# EAGLE design 01_FETCH_INCREMENT (EAGLE 7.5.0)
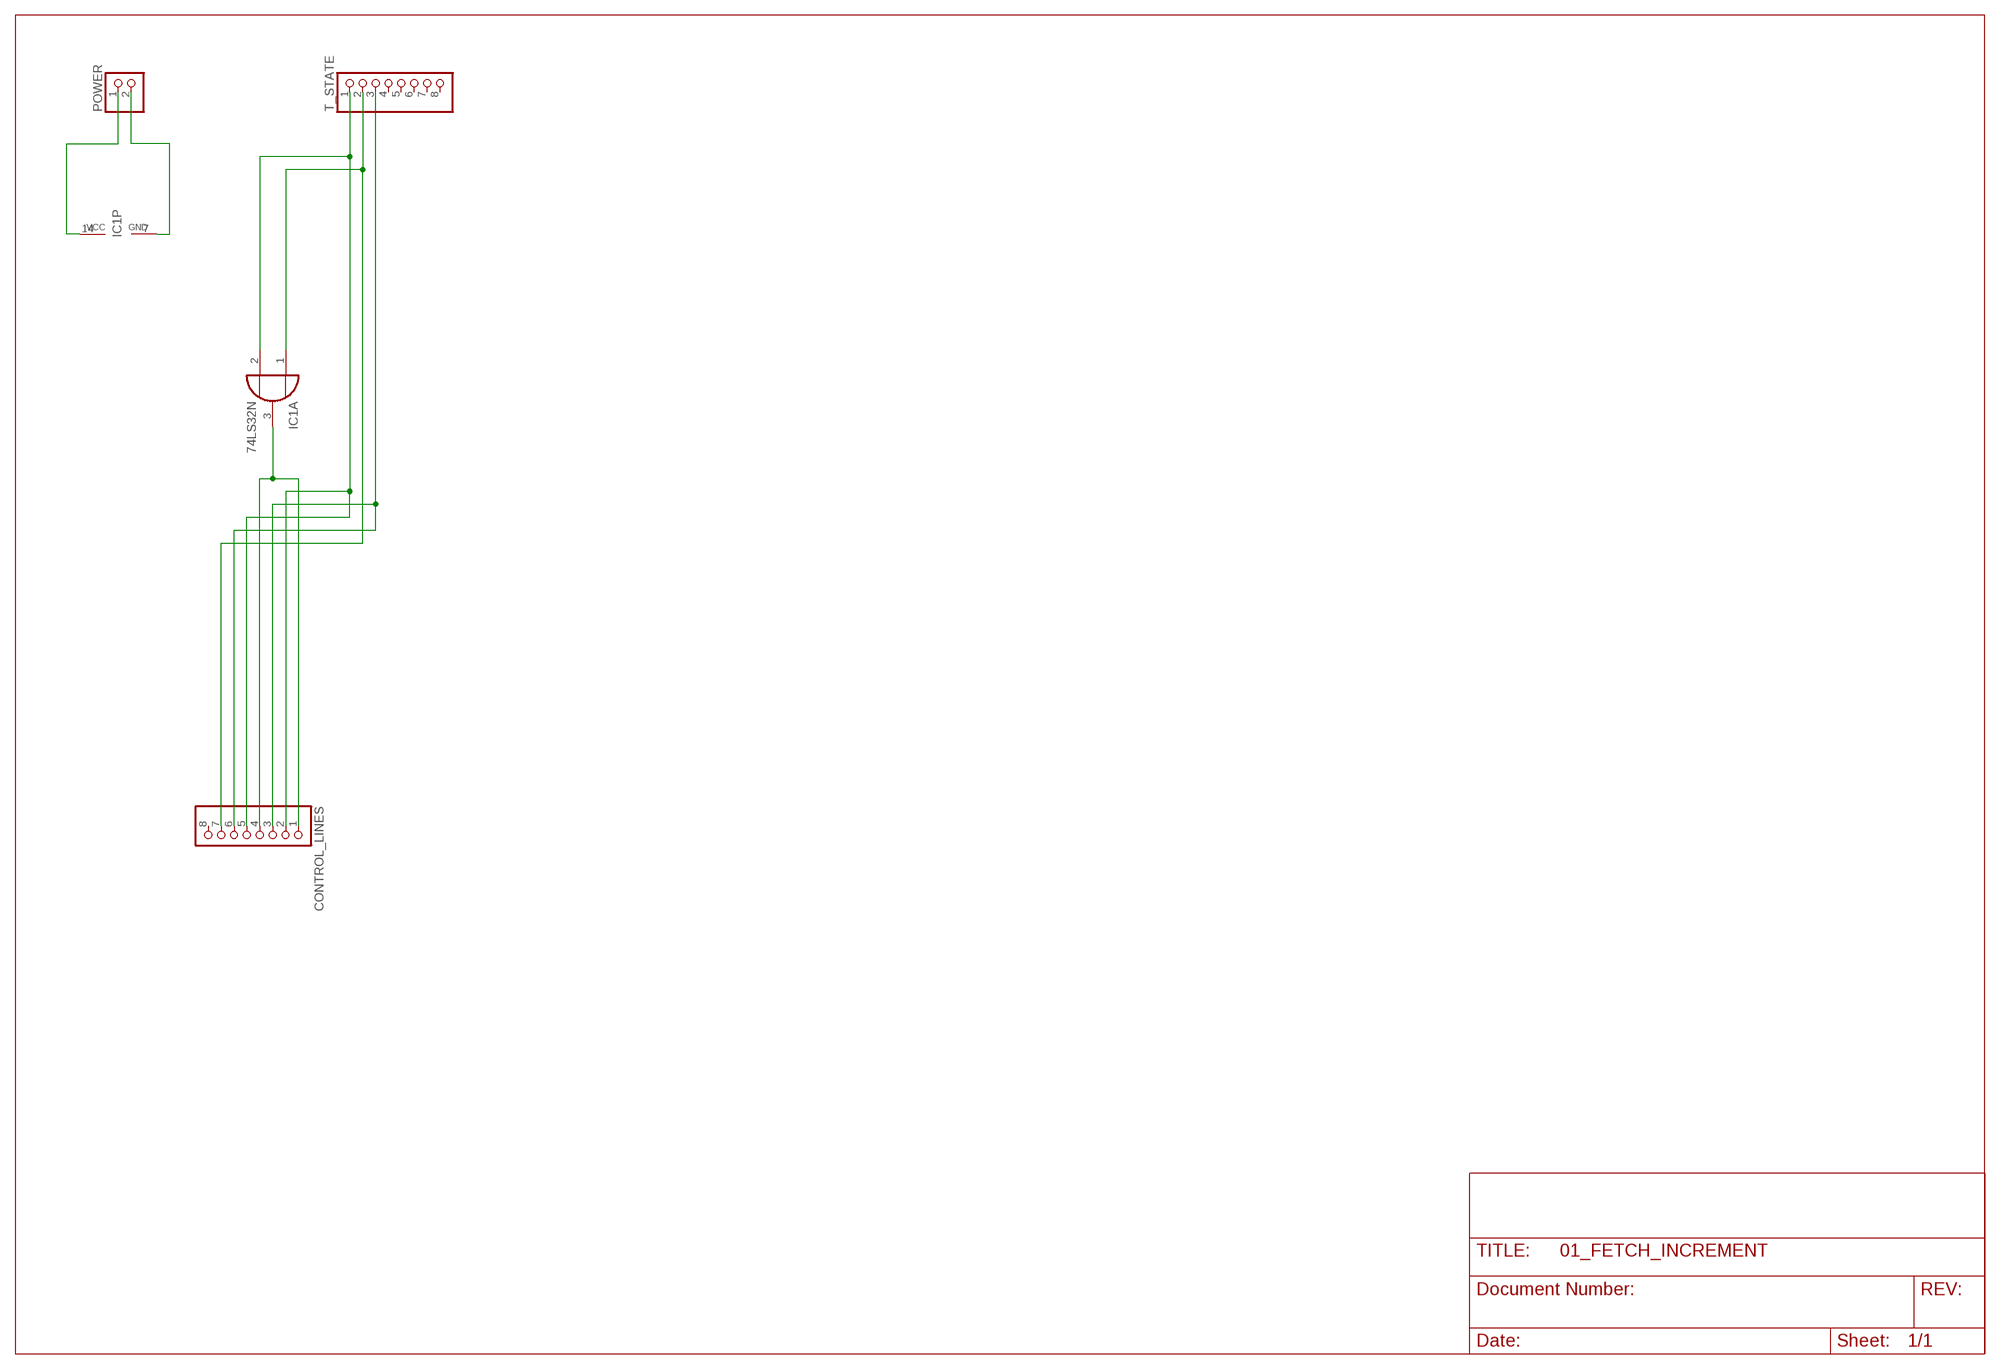
[diagram p0: schematic, sheet 1]

## Parts
CONTROL_LINES  PINHD-1X8  [1X08]
IC1  74LS32N  [DIL14]
POWER  PINHD-1X2  [1X02]
T_STATE  PINHD-1X8  [1X08]

## Nets
GND: IC1.7(P:GND) POWER.2
N$1: CONTROL_LINES.2 CONTROL_LINES.5 IC1.2(A:I1) T_STATE.1
N$2: CONTROL_LINES.7 IC1.1(A:I0) T_STATE.2
N$3: CONTROL_LINES.1 CONTROL_LINES.4 IC1.3(A:O)
N$5: CONTROL_LINES.3 CONTROL_LINES.6 T_STATE.3
VCC: IC1.14(P:VCC) POWER.1
Unconnected: CONTROL_LINES.8 IC1.4(B:I0) IC1.5(B:I1) IC1.6(B:O) IC1.8(C:O) IC1.9(C:I0) IC1.10(C:I1) IC1.11(D:O) IC1.12(D:I0) IC1.13(D:I1) T_STATE.4 T_STATE.5 T_STATE.6 T_STATE.7 T_STATE.8

## Library data of the parts
CONTROL_LINES T_STATE = pinhead:PINHD-1X8: PIN HEADER
IC1 = 74xx-eu:74*32: Quad 2-input OR gate
POWER = pinhead:PINHD-1X2: PIN HEADER

## Board
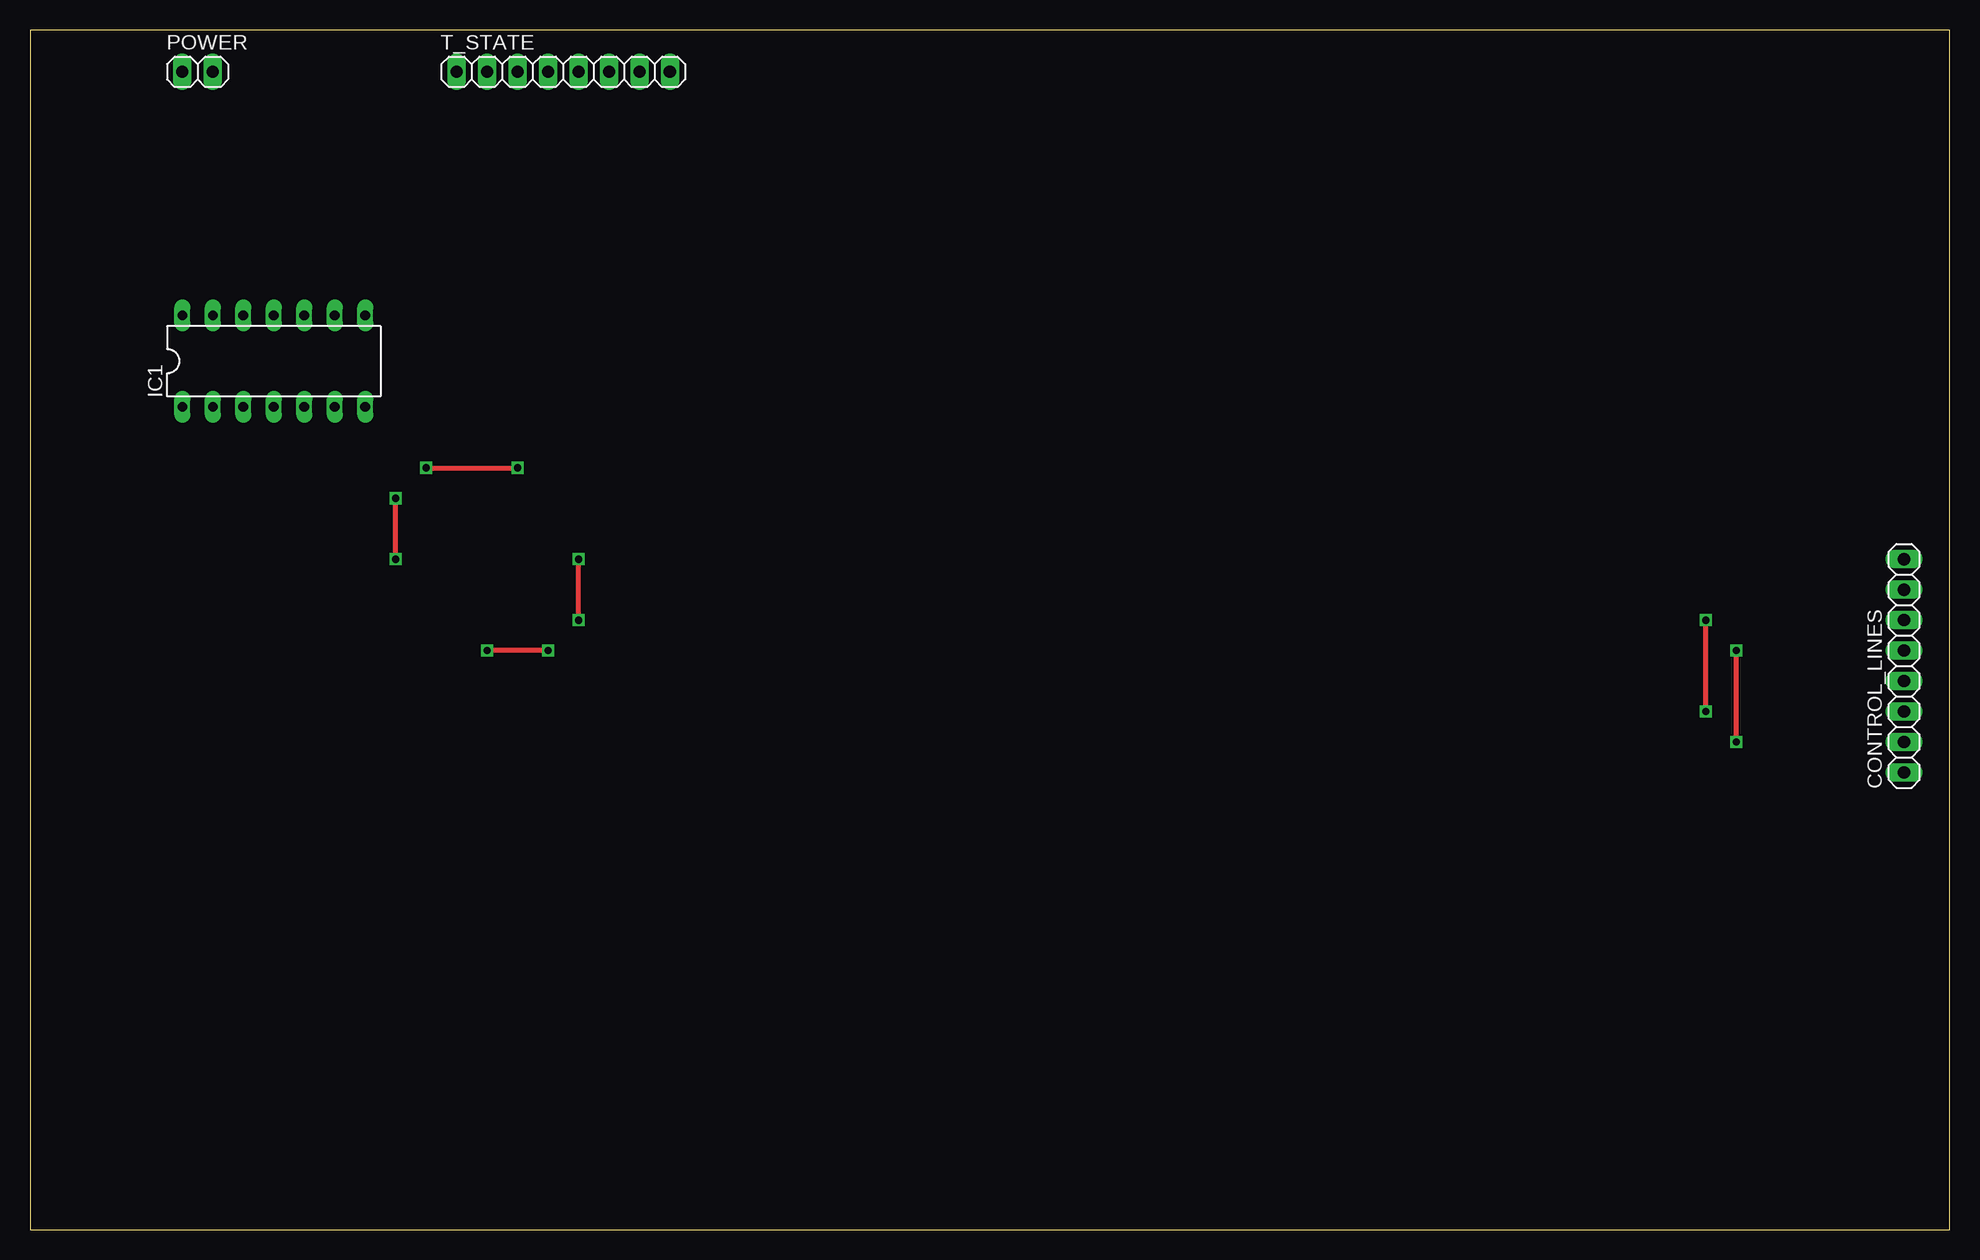
[diagram p1: board, top side]
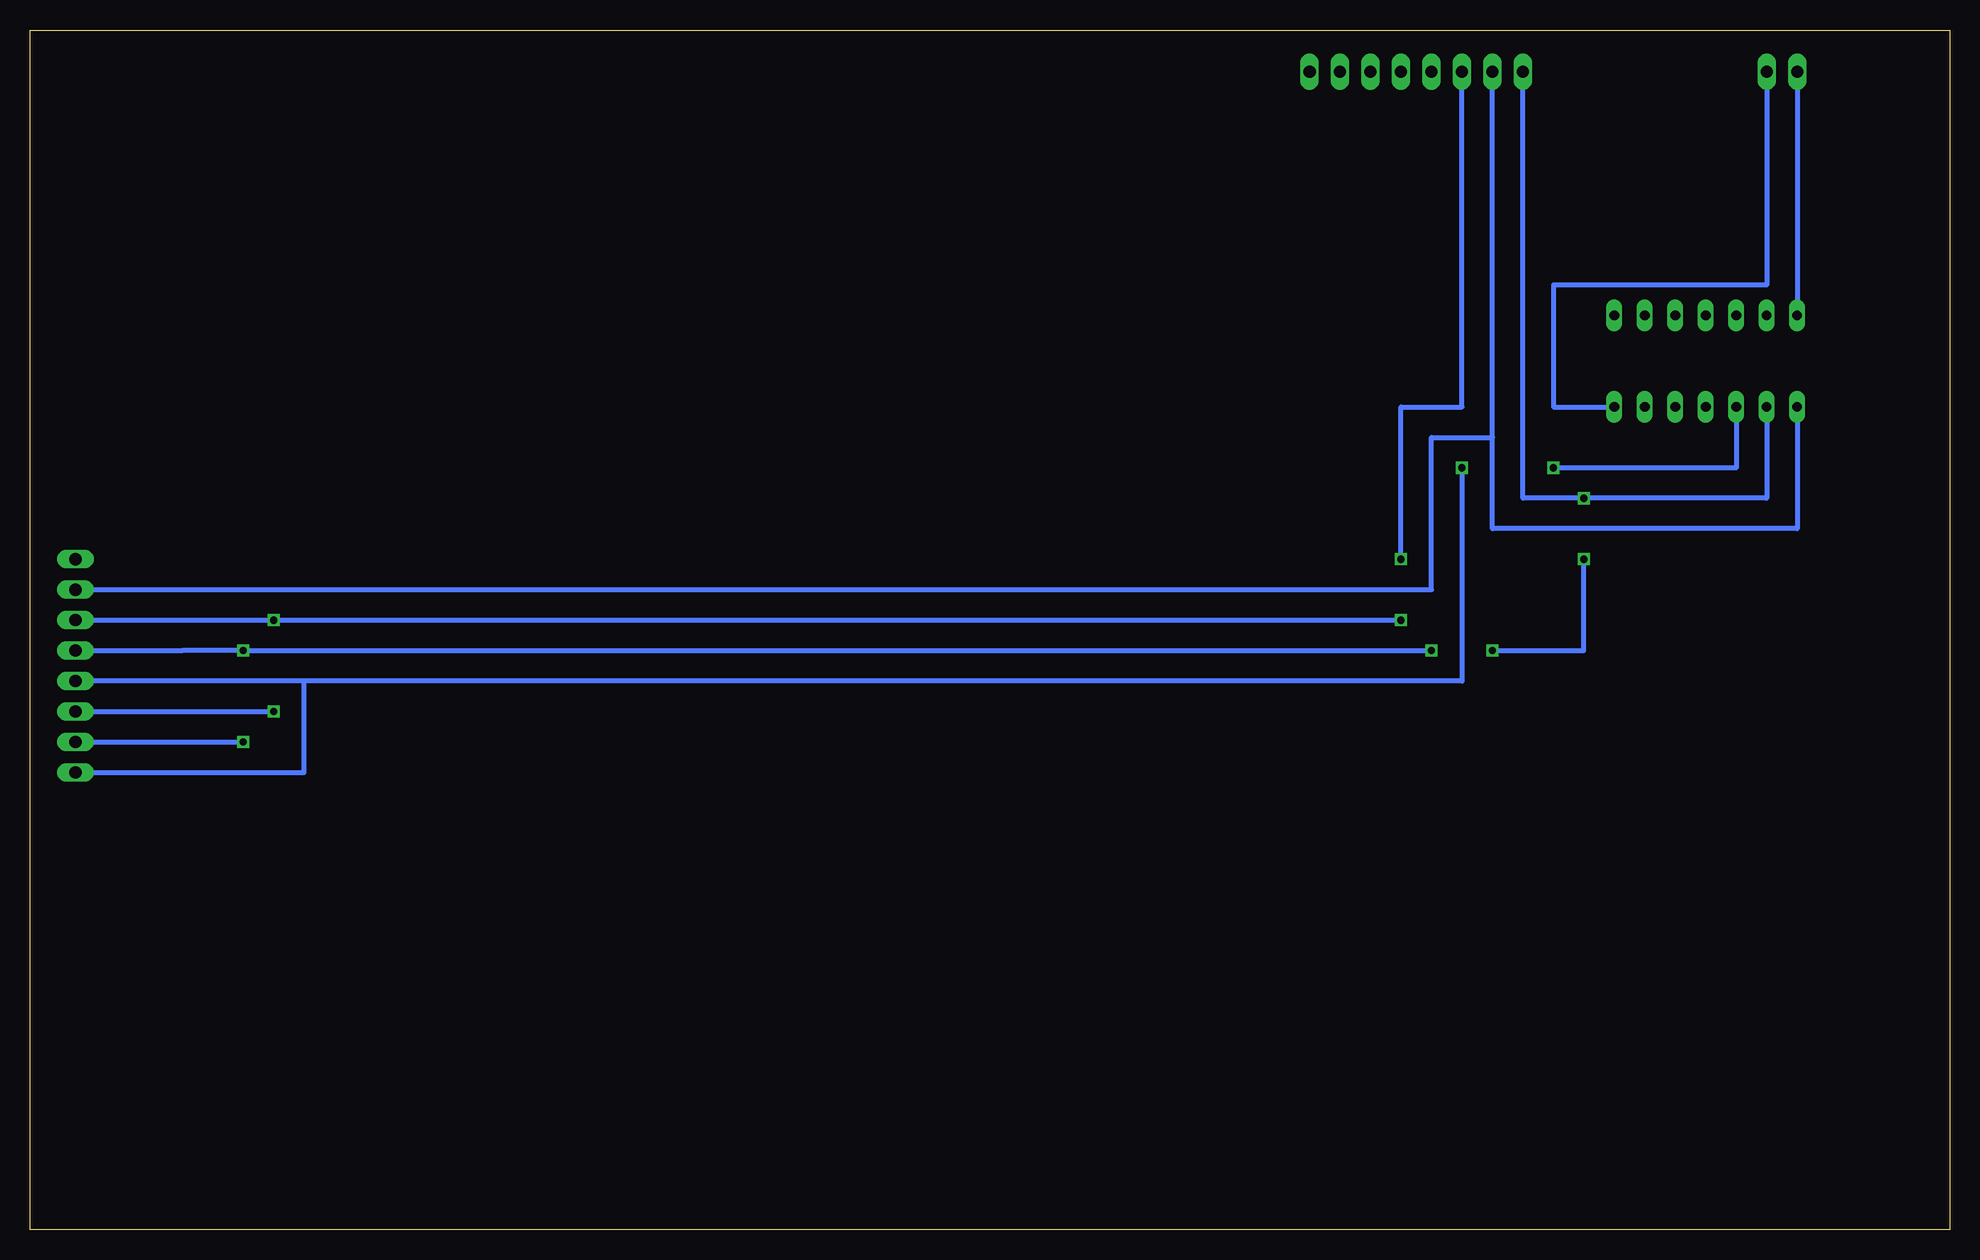
[diagram p2: board, bottom side, seen from below]

Size 160 x 100 mm. Coordinates in mm from the lower left corner, seen from the top.
Outline: 0,0 160,0 160,100 0,100 0,0
Copper layers (1*16): Top 0.035mm / dielectric 1.5mm / Bottom 0.035mm
Design rules "default": minimum track width 10mil, minimum drill 24mil, track to track 8mil, track to pad 8mil, pad to pad 8mil, via to via 8mil, smd to smd 8mil, copper to edge 40mil, drill to drill 8mil, minimum pad ring 10mil, minimum via ring 8mil, stop-mask expansion 4mil, vias tented up to drill 0mil, thermal gap 10mil

### Footprints (pad centres in the part's own frame; a part is rotated, then mirrored left to right if it is on the bottom)
1X08 = drill 1.016 long: 1 -8.89,0; 2 -6.35,0; 3 -3.81,0; 4 -1.27,0; 5 1.27,0; 6 3.81,0; 7 6.35,0; 8 8.89,0
DIL14 = drill 0.813 long: 1 -7.62,-3.81; 2 -5.08,-3.81; 3 -2.54,-3.81; 4 0,-3.81; 5 2.54,-3.81; 6 5.08,-3.81; 7 7.62,-3.81; 8 7.62,3.81; 9 5.08,3.81; 10 2.54,3.81; 11 0,3.81; 12 -2.54,3.81; 13 -5.08,3.81; 14 -7.62,3.81
1X02 = drill 1.016 long: 1 -1.27,0; 2 1.27,0

### Placement (x,y rotation side)
CONTROL_LINES  156.21,46.99 90 top
IC1  20.32,72.39 0 top
POWER  13.97,96.52 0 top
T_STATE  44.45,96.52 0 top

### Tracks (layer width: path | path; a pad name or v marks a point on that pad's centre or on a via)
GND
  Bottom 0.406: POWER.2 15.24,78.74 33.02,78.74 33.02,68.58 IC1.7
N$1  (via drill 0.6)
  Top 0.406: v43.18,48.26 v38.1,48.26 | v30.48,55.88 v30.48,60.96 | v142.24,40.64 v142.24,48.26
  Bottom 0.406: IC1.2 15.24,60.96 v30.48,60.96 35.56,60.96 T_STATE.1 | CONTROL_LINES.5 147.32,48.26 v142.24,48.26 v43.18,48.26 | v38.1,48.26 30.48,48.26 v30.48,55.88 | CONTROL_LINES.2 v142.24,40.64
N$2
  Bottom 0.406: IC1.1 12.7,58.42 38.1,58.42 38.1,66.04 | 38.1,66.04 T_STATE.2 | CONTROL_LINES.7 43.18,53.34 43.18,66.04 38.1,66.04
N$3  (via drill 0.6)
  Top 0.406: v33.02,63.5 v40.64,63.5
  Bottom 0.406: IC1.3 17.78,63.5 v33.02,63.5 | v40.64,63.5 40.64,45.72 137.16,45.72 | 137.16,45.72 CONTROL_LINES.4 | CONTROL_LINES.1 137.16,38.1 137.16,45.72
N$5  (via drill 0.6)
  Top 0.406: v45.72,50.8 v45.72,55.88 | v139.7,43.18 v139.7,50.8
  Bottom 0.406: CONTROL_LINES.6 v139.7,50.8 137.16,50.8 v45.72,50.8 | v45.72,55.88 45.72,68.58 40.64,68.58 T_STATE.3 | CONTROL_LINES.3 v139.7,43.18
VCC
  Bottom 0.406: POWER.1 IC1.14